# Altium schematic sheet TVR_Rev2_Microcontroller.SchDoc
size A4; SheetNumber: 1; SheetTotal: 4
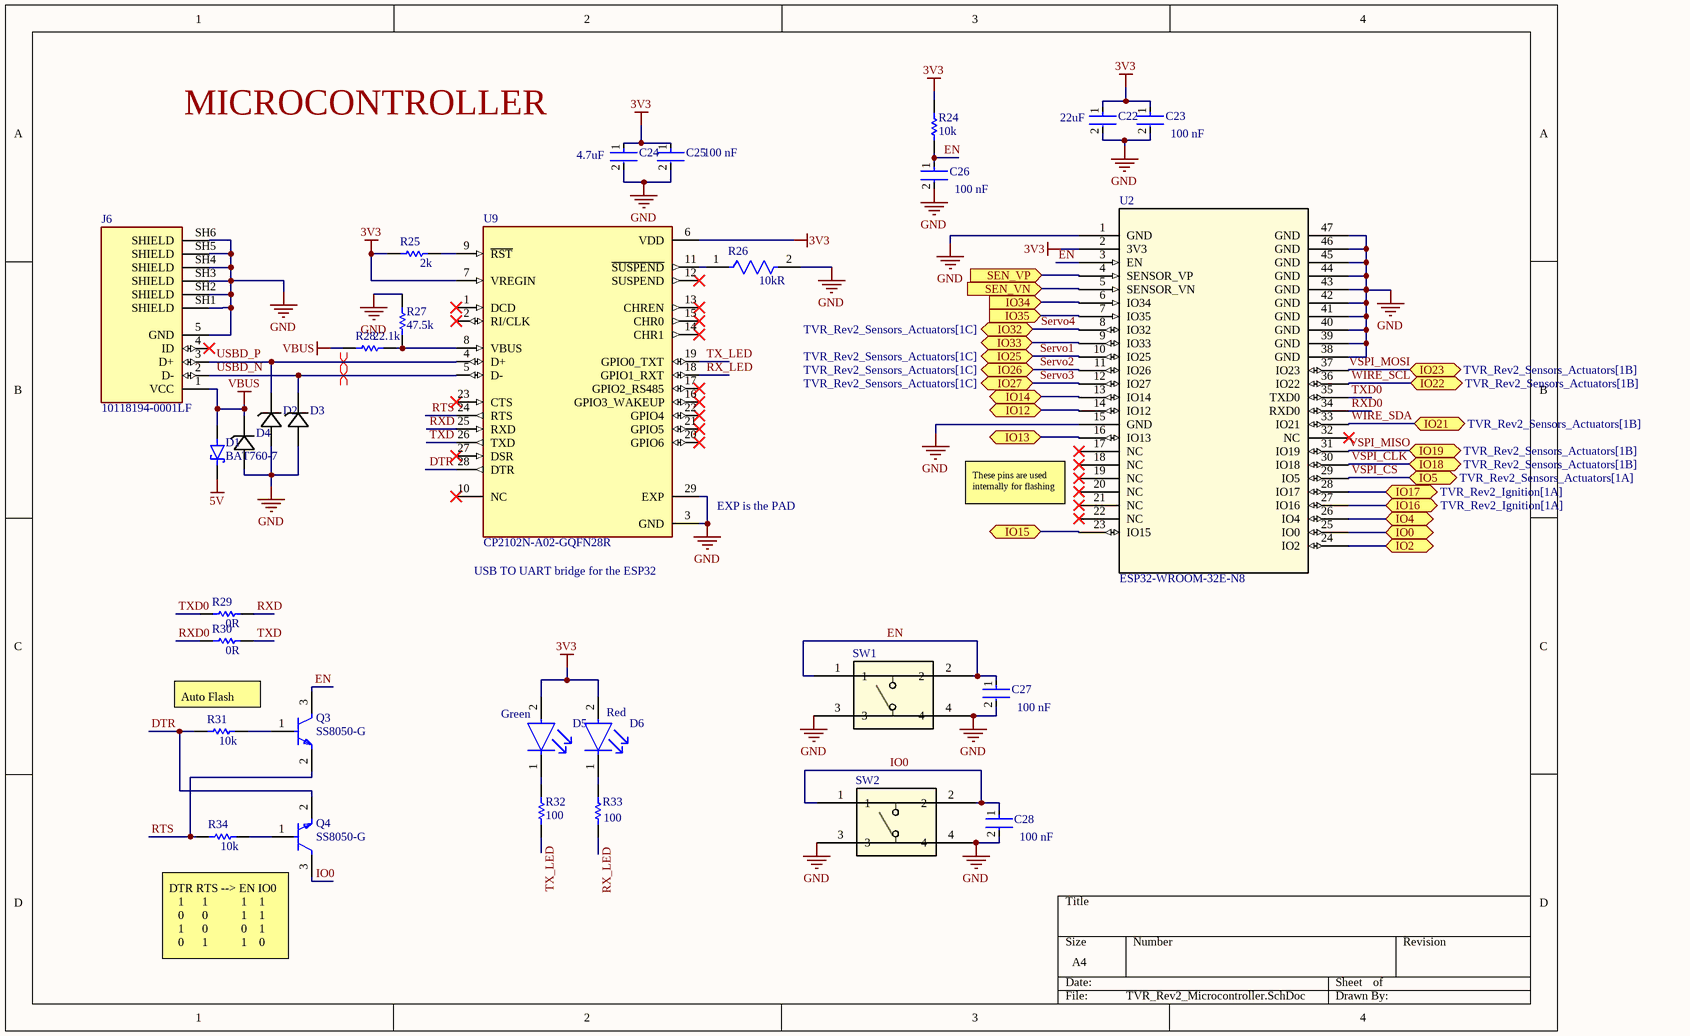
[diagram p0: TVR_Rev2_Microcontroller.SchDoc]

## Parts
C22  Capacitance: 22uF  [FP-GRM21B-0_2-e0_2_0_7-IPC_B]  (hidden comment: GRM21BR61E226ME44L)
C23  Capacitance: 100 nF  [FP-CC0805-0_85-MFG]  (hidden comment: CC0805KRX7R9BB104)
C24  Capacitance: 4.7uF  [FP-GRM21B-0_15-IPC_B]  (hidden comment: GRM21BR61H475KE51L)
C25  Capacitance: 100 nF  [FP-CC0805-0_85-MFG]  (hidden comment: CC0805KRX7R9BB104)
C26  Capacitance: 100 nF  [FP-CC0805-0_85-MFG]  (hidden comment: CC0805KRX7R9BB104)
C27  Capacitance: 100 nF  [FP-CC0805-0_85-MFG]  (hidden comment: CC0805KRX7R9BB104)
C28  Capacitance: 100 nF  [FP-CC0805-0_85-MFG]  (hidden comment: CC0805KRX7R9BB104)
D1  BAT760-7  [SOD2513X120N]
D2  CPDQ5V0-HF  [CPDQ]  (value not drawn)
D3  CPDQ5V0-HF  [CPDQ]  (value not drawn)
D4  CPDQ5V0-HF  [CPDQ]  (value not drawn)
D5  Color: Green  [FP-LTST-C171GKT-MFG]  (hidden comment: LTST-C171GKT)
D6  Color: Red  [FP-LTST-C171GKT-MFG]  (hidden comment: LTST-C171KRKT)
J6  10118194-0001LF  [AMPHENOL_10118194-0001LF]
Q3  SS8050-G  [FP-SS8050-G-MFG]
Q4  SS8050-G  [FP-SS8050-G-MFG]
R24  Resistance: 10k  [RESC2013X60X35NL10T20]  (hidden comment: RC0805FR-0710KL)
R25  Resistance: 2k  [RESC2013X70X40NL20T20]  (hidden comment: ERJ-6ENF2001V)
R26  Resistance: 10kR  [FP-RMCF0805-IPC_A]  (hidden comment: RMCF0805JT10K0)
R27  Resistance: 47.5k  [RESC2013X70X40NL20T20]  (hidden comment: ERJ-6ENF4752V)
R28  Resistance: 22.1k  [RESC2013X50X30LL20T20]  (hidden comment: CRCW080522K1FKTA)
R29  Resistance: 0R  [RESC2013X50X30LL20T20]  (hidden comment: CRCW08050000Z0EA)
R30  Resistance: 0R  [RESC2013X50X30LL20T20]  (hidden comment: CRCW08050000Z0EA)
R31  Resistance: 10k  [RESC2013X60X35NL10T20]  (hidden comment: RC0805FR-0710KL)
R32  Resistance: 100  [RESC2013X60X40ML20T25]  (hidden comment: ERA6AEB101V)
R33  Resistance: 100  [RESC2013X60X40ML20T25]  (hidden comment: ERA6AEB101V)
R34  Resistance: 10k  [RESC2013X60X35NL10T20]  (hidden comment: RC0805FR-0710KL)
SW1  PTS645SM43SMTR92LFS  [SWITCH_43SMTR92LFS]  (value not drawn)
SW2  PTS645SM43SMTR92LFS  [SWITCH_43SMTR92LFS]  (value not drawn)
U2  ESP32-WROOM-32E-N8  [ESP32­WROOM­32E_EXP]
U9  CP2102N-A02-GQFN28R  [IC_CP2102N-A02-GQFN28R]

## Ports
IO0 (bidir), IO2 (bidir), IO4 (bidir), IO5 (bidir, see TVR_Rev2_Sensors_Actuators[1A]), IO12 (bidir), IO13 (bidir), IO14 (bidir), IO15 (bidir), IO16 (bidir, see TVR_Rev2_Ignition[1A]), IO17 (bidir, see TVR_Rev2_Ignition[1A]), IO18 (bidir, see TVR_Rev2_Sensors_Actuators[1B]), IO19 (bidir, see TVR_Rev2_Sensors_Actuators[1B]), IO21 (bidir, see TVR_Rev2_Sensors_Actuators[1B]), IO22 (bidir, see TVR_Rev2_Sensors_Actuators[1B]), IO23 (bidir, see TVR_Rev2_Sensors_Actuators[1B]), IO25 (bidir, see TVR_Rev2_Sensors_Actuators[1C]), IO26 (bidir, see TVR_Rev2_Sensors_Actuators[1C]), IO27 (bidir, see TVR_Rev2_Sensors_Actuators[1C]), IO32 (bidir, see TVR_Rev2_Sensors_Actuators[1C]), IO33 (bidir), IO34 (in), IO35 (in), SEN_VN (in), SEN_VP (in)

## Nets
3V3: C22.1 C23.1 C24.1 C25.1 D5.2(A) D6.2(A) R24.2 R25.1 U2.2(3V3) U9.6(VDD) U9.7(VREGIN)
5V: D1.C(K)
GND: C22.2 C23.2 C24.2 C25.2 C26.2 C27.2 C28.2 D2.2 D3.2 D4.2 J6.5(GND) J6.SH1(SHIELD) J6.SH2(SHIELD) J6.SH3(SHIELD) J6.SH4(SHIELD) J6.SH5(SHIELD) J6.SH6(SHIELD) R26.2 R27.2 SW1.3 SW1.4 SW2.3 SW2.4 U2.1(GND) U2.15(GND) U2.38(GND) U2.39(GND) U2.40(GND) U2.41(GND) U2.42(GND) U2.43(GND) U2.44(GND) U2.45(GND) U2.46(GND) U2.47(GND) U9.3(GND) U9.29(EXP)
VBUS: D1.A D4.1 J6.1(VCC) R28.1
DTR: Q4.2(E) R31.1 U9.28(DTR)
EN: C26.1 C27.1 Q3.3(C) R24.1 SW1.1 SW1.2 U2.3(EN)
IO0: U2.25(IO0) ; port IO0
IO0: C28.1 Q4.3(C) SW2.1 SW2.2  [a separate net that carries the same name]
IO2: U2.24(IO2) ; port IO2
IO4: U2.26(IO4) ; port IO4
IO12: U2.14(IO12) ; port IO12
IO13: U2.16(IO13) ; port IO13
IO14: U2.13(IO14) ; port IO14
IO15: U2.23(IO15) ; port IO15
IO16: U2.27(IO16) ; port IO16
IO17: U2.28(IO17) ; port IO17
IO33: U2.9(IO33) ; port IO33
IO34: U2.6(IO34) ; port IO34
IO35: U2.7(IO35) ; port IO35
RTS: Q3.2(E) R34.1 U9.24(RTS)
RX_LED: R33.1 U9.18(GPIO1_RXT)
RXD: R29.2 U9.25(RXD)
RXD0: R30.1 U2.34(RXD0)
SEN_VN: U2.5(SENSOR_VN) ; port SEN_VN
SEN_VP: U2.4(SENSOR_VP) ; port SEN_VP
Servo1: U2.10(IO25) ; port IO25
Servo2: U2.11(IO26) ; port IO26
Servo3: U2.12(IO27) ; port IO27
Servo4: U2.8(IO32) ; port IO32
TX_LED: R32.1 U9.19(GPIO0_TXT)
TXD: R30.2 U9.26(TXD)
TXD0: R29.1 U2.35(TXD0)
USBD_N: D3.1 J6.2(D-) U9.5(D-)
USBD_P: D2.1 J6.3(D+) U9.4(D+)
VSPI_CLK: U2.30(IO18) ; port IO18
VSPI_CS: U2.29(IO5) ; port IO5
VSPI_MISO: U2.31(IO19) ; port IO19
VSPI_MOSI: U2.37(IO23) ; port IO23
WIRE_SCL: U2.36(IO22) ; port IO22
WIRE_SDA: U2.33(IO21) ; port IO21
NetD5_1: D5.1(C) R32.2
NetD6_1: D6.1(C) R33.2
NetQ3_1: Q3.1(B) R31.2
NetQ4_1: Q4.1(B) R34.2
NetR25_2: R25.2 U9.9(~{RST})
NetR26_1: R26.1 U9.11(~{SUSPEND})
NetR27_1: R27.1 R28.2 U9.8(VBUS)

Not connected (* = marked no-connect by the designer): J6 4(ID)*; U2 17(NC)* 18(NC)* 19(NC)* 20(NC)* 21(NC)* 22(NC)* 32(NC)*; U9 1(DCD)* 2(RI/CLK)* 10(NC)* 12(SUSPEND)* 13(CHREN)* 14(CHR1)* 15(CHR0)* 16(GPIO3_WAKEUP)* 17(GPIO2_RS485)* 20(GPIO6)* 21(GPIO5)* 22(GPIO4)* 23(CTS)* 27(DSR)*

## Layout directives
differential pair: USBD_N, USBD_P

## Notes on the sheet
- MICROCONTROLLER
- (near U9) EXP is the PAD
- These pins are used internally for flashing
- (near U9) USB TO UART bridge for the ESP32
- Auto Flash
- DTR RTS --> EN IO0
  1      1           1    1
  0      0           1    1
  1      0           0    1
  0      1           1    0

## Library data of the parts
C22 = CMP-2007-03222-3: Chip Multilayer Ceramic Capacitors for General Purpose, 0805, 22uF, X5R, 15%, 20%, 25V; Case/Package: 0805; Depth: 1.25mm; Resistor Type: Ceramic; Voltage Rating: 25V; Lead Free: Lead Free; Voltage Rating (DC): 25V; Case Code (Metric): 2012; Thickness: 0.057inch; REACH SVHC: No SVHC; Material: Ceramic; Tolerance: 20%; Length: 2mm; Case Code (Imperial): 0805; Max Operating Temperature: 85°C; Termination: SMD/SMT; Weight: 0.000335oz; Dielectric: X5R; Packaging: Tape and Reel; Voltage: 25V; Package Quantity: 3000; Height: 1.25mm; Mount: Surface Mount; Width: 1.25mm; Min Operating Temperature: -55°C
C23 C25-C28 = CMP-2100-03606-3: CAP CER 0.1UF 50V X7R 0805; Manufacturer: Yageo; Tolerance: 0.1; Value: 100 nF; Material: Ceramic; Device Class L1: Passive Components; ComponentLink2Description: Datasheet; Package: CC0805-0.85; Manufacturer Part Number: CC0805KRX7R9BB104; Digikey Description: CAP CER 0.1UF 50V X7R 0805; Device Class L3: Ceramic Capacitors; Temperature: -30°C to +85°C; Temperature Characteristic: X7R; Voltage Rating: 50 V; Height: 0.95mm; RoHS: TRUE; Ipc Land Pattern Name: CAPC200125X85; Device Class L2: Capacitors; Category: Cap; Temperature Range Low: -30°C; Temperature Range High: +85°C; Mouser Description: Multilayer Ceramic Capacitors MLCC - SMD/SMT 100nF 50V X7R 10%; Footprint Url: http://www.yageo.com/exep/pages/download/literatures/UPY-C_GEN_24.pdf; Automotive: No; Octopart: https://octopart.com/cc0805krx7r9bb104-yageo-192993; Lead Free: Yes; ComponentLink2URL: http://www.yageo.com/documents/recent/UPY-GPHC_Y5V_6.3V-to-50V_8.pdf
C24 = CMP-06035-059131-1: Chip Multilayer Ceramic Capacitors for General Purpose, 0805, 4.7uF, X5R, 15%, 10%, 50V; Case Code (Metric): 2012; Height: 1.25mm; Width: 0.049inch; Packaging: Tape and Reel; Mount: Surface Mount; Case/Package: 0805; REACH SVHC: No SVHC; Case Code (Imperial): 0805; Dielectric: X5R; Thickness: 0.055inch; Voltage Rating: 50V; Material: Ceramic; Depth: 1.25mm; Min Operating Temperature: -55°C; Lead Free: Lead Free; Max Operating Temperature: 85°C; Tolerance: 10%; Length: 2mm; Voltage Rating (DC): 50V
D1 = BAT760-7: Diode Schottky 30V 1A 2-Pin SOD-323 T/R; MF: Diodes Zetex; MP: BAT760-7; SnapEDA_Link: https://www.snapeda.com/parts/BAT760-7/Zetex/view-part/4817231/?ref=snap; Value: *; DigiKey-Purchase-URL: https://snapeda.com/shop?store=DigiKey&id=4817231; Package: None; Mouser-Purchase-URL: https://snapeda.com/shop?store=Mouser&id=4817231; Price: None; Availability: Good; BuyPart: https://www.snapeda.com/parts/BAT760-7/Zetex/view-part/4817231/?ref=eda
D2-D4 = CPDQ5V0-HF: No Description Available; Mfr_Name: Comchip
D5 = CMP-22017-000007-1: LED GREEN CLEAR CHIP SMD; Luminous Intensity: 12mcd; Lens Color: Colorless; Dominant Wavelength: 569nm; Number of LEDs: 1; Power Dissipation: 100mW; Viewing Angle: 130°; Reverse Voltage: 5V; Test Current: 10mA; Forward Voltage: 2.1V; Wavelength: 585nm; Lens Style: Diffused; Forward Current: 30mA; Height: 0.8mm; Mount: Surface Mount; Package Quantity: 1; Length: 2mm; Case Code (Metric): 2012; Number of Pins: 2; Number of Elements: 1; Packaging: Tape and Reel; Min Operating Temperature: -55°C; Case/Package: 0805; Power Rating: 100mW; Max Operating Temperature: 85°C; Radiation Hardening: No; Depth: 1.25mm; Lens Transparency: Clear; Width: 1.25mm; Lead Free: Lead Free; Case Code (Imperial): 0805; Illumination Color: Green
D6 = CMP-22017-000007-1: LED RED CLEAR CHIP SMD; Luminous Intensity: 12mcd; Lens Color: Colorless; Dominant Wavelength: 569nm; Number of LEDs: 1; Power Dissipation: 100mW; Viewing Angle: 130°; Reverse Voltage: 5V; Test Current: 10mA; Forward Voltage: 2.1V; Wavelength: 585nm; Lens Style: Diffused; Forward Current: 30mA; Height: 0.8mm; Mount: Surface Mount; Package Quantity: 1; Length: 2mm; Case Code (Metric): 2012; Number of Pins: 2; Number of Elements: 1; Packaging: Tape and Reel; Min Operating Temperature: -55°C; Case/Package: 0805; Power Rating: 100mW; Max Operating Temperature: 85°C; Radiation Hardening: No; Depth: 1.25mm; Lens Transparency: Clear; Width: 1.25mm; Lead Free: Lead Free; Case Code (Imperial): 0805; Illumination Color: Red
J6 = 10118194-0001LF: Micro USB, Input Output Connectors, B TYPE RECEPTACLE with flange; MF: Amphenol ICC; SnapEDA_Link: https://www.snapeda.com/parts/10118194-0001LF/Amphenol+FCI/view-part/?ref=snap; Package: None; Value: *; MP: 10118194-0001LF; Check_prices: https://www.snapeda.com/parts/10118194-0001LF/Amphenol+FCI/view-part/?ref=eda
Q3 Q4 = CMP-20235-000001-1: NPN TRANSISTOR 1.5A 40V SOT-23 R; Transition Frequency: 100MHz; Max Breakdown Voltage: 25V; Collector Emitter Voltage (VCEO): 400mV; Max Power Dissipation: 300mW; Max Collector Current: 1.5A; Case/Package: TO-236-3; Packaging: Tape and Reel; RoHS Compliant: Yes; Mount: Surface Mount; Collector Emitter Breakdown Voltage: 25V
R24 R31 R34 = CMP-1659-00013-4: Chip Resistor, 10 KOhm, +/- 1%, 0.125 W, -55 to 155 degC, 0805 (2012 Metric), RoHS, Tape and Reel; Manufacturer: Yageo; Voltage Rating: 150 V; Mount: Surface Mount; ComponentLink1Description: Manufacturer URL; ComponentLink2URL: http://www.yageo.com/documents/recent/PYu-RC_Group_51_RoHS_L_04.pdf; Pins: 2; Length: 2 mm; Min Operating Temperature: -55 degC; Height: 0.5 mm; Mounting Technology: Surface Mount; RoHSCompliant: true; REACH SVHC: No SVHC; ComponentLink1URL: http://www.yageo.com/; Max Operating Temperature: 155 degC; PackageReference: 0805; DatasheetVersion: Rev. 4, 02/2016; Package Quantity: 5000; Packaging: Tape and Reel; ComponentLink2Description: Datasheet; PackageDescription: 2-Pin Surface Mounted Device, Body 2 x 1.25 mm
R25 = CMP-2001-00026-5: Chip Resistor, 2 KOhm, +/- 1%, 0.125 W, -55 to 155 degC, 0805 (2012 Metric), RoHS, Tape and Reel; Manufacturer: Panasonic; Voltage Rating: 150 V; RoHSCompliant: true; Packaging: Tape and Reel; ComponentLink2Description: Datasheet; DatasheetVersion: 04/2015; Min Operating Temperature: -55 degC; Max Operating Temperature: 155 degC; Mounting Technology: Surface Mount; Length: 2 mm; Package Quantity: 5000; REACH SVHC: Unknown; ComponentLink1URL: http://www.panasonic.com/; ComponentLink2URL: http://industrial.panasonic.com/cdbs/www-data/pdf/RDA0000/AOA0000C86.pdf; Mount: Surface Mount; PackageReference: 0805; ComponentLink1Description: Manufacturer URL; PackageDescription: 2-Pin Surface Mount Device, Body 2 x 1.25 mm; Height: 0.6 mm
R26 = CMP-26527-002663-1: 10kΩ ±5% 0.125W 0805 Thick Film Chip Resistor AEC-Q200 compliant; Max Power Dissipation: 125mW; Temperature Coefficient: 100ppm/°C; Construction: Rectangular; RoHS Compliant: Yes; Resistor Type: Thick Film; Series: RMCF; Features: Automotive AEC-Q200; Case Code (Imperial): 0805; Mount: Surface Mount; Min Operating Temperature: -55°C; Military Standard: Not; Tolerance: 5%; Size Code: 0805; Contact Plating: Tin; Length: 2mm; Depth: 1.25mm; Case Code (Metric): 2012; Packaging: Tape and Reel; Radiation Hardening: No; Height: 0.026inch; Case/Package: 0805; Width: 0.049inch; Lead Free: Lead Free; Max Operating Temperature: 155°C; Number of Terminations: 2; Power Rating: 125mW
R27 = CMP-1013-00700-2: Manufacturer: Panasonic; Part Number: ERJ-6ENF4752V
R28 = CMP-1013-00660-2: Manufacturer: Vishay Dale; Part Number: CRCW080522K1FKTA
R29 R30 = CMP-2001-04896-1: Manufacturer: Vishay Dale; Part Number: CRCW08050000Z0EA
R32 R33 = CMP-2001-00580-1: Manufacturer: Panasonic; Part Number: ERA6AEB101V
SW1 SW2 = PTS645SM43SMTR92LFS: No Description Available; Mfr_Name: C&K Components; RefDes: RefDes; Type: Type
U2 = ESP32-WROOM-32E-N8: No Description Available; Mfr_Name: Espressif Systems; RefDes: RefDes; Type: Type
U9 = CP2102N-A02-GQFN28R: USB Bridge, USB to UART USB 2.0 UART Interface 28-QFN (5x5); MF: Silicon Labs; SnapEDA_Link: https://www.snapeda.com/parts/CP2102N-A02-GQFN28R/Silicon+Labs/view-part/?ref=snap; Package: None; Value: *; MP: CP2102N-A02-GQFN28R; Check_prices: https://www.snapeda.com/parts/CP2102N-A02-GQFN28R/Silicon+Labs/view-part/?ref=eda